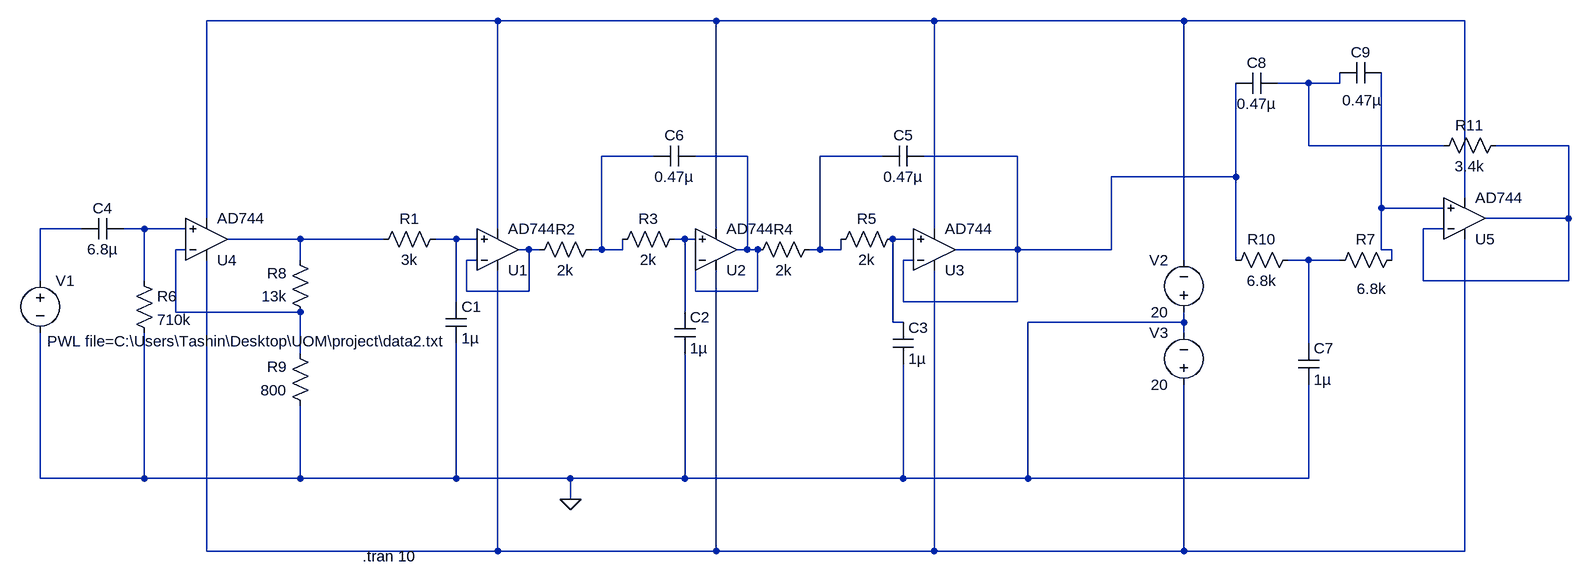
[diagram p0: schematic filter circuit.asc]
filter circuit.asc, the LTspice schematic file:
Version 4
SHEET 1 1656 680
WIRE 0 -272 -448 -272
WIRE 336 -272 0 -272
WIRE 672 -272 336 -272
WIRE 1056 -272 672 -272
WIRE 1488 -272 1056 -272
WIRE 1248 -176 1200 -176
WIRE 1296 -176 1296 -192
WIRE 1296 -176 1248 -176
WIRE 1248 -80 1248 -176
WIRE 1456 -80 1248 -80
WIRE 1648 -80 1536 -80
WIRE 240 -64 160 -64
WIRE 384 -64 304 -64
WIRE 592 -64 496 -64
WIRE 800 -64 656 -64
WIRE 1136 -32 1136 -176
WIRE 1136 -32 944 -32
WIRE 1488 0 1488 -272
WIRE 1360 16 1360 -192
WIRE 1456 16 1360 16
WIRE -448 32 -448 -272
WIRE 1648 32 1648 -80
WIRE 1648 32 1520 32
WIRE -640 48 -704 48
WIRE -544 48 -576 48
WIRE -480 48 -544 48
WIRE 0 48 0 -272
WIRE 336 48 336 -272
WIRE 672 48 672 -272
WIRE 1456 48 1424 48
WIRE -304 64 -416 64
WIRE -176 64 -304 64
WIRE -64 64 -96 64
WIRE -32 64 -64 64
WIRE 288 64 272 64
WIRE 304 64 288 64
WIRE 640 64 608 64
WIRE -480 80 -496 80
WIRE 48 80 32 80
WIRE 64 80 48 80
WIRE 160 80 160 -64
WIRE 160 80 144 80
WIRE 192 80 192 64
WIRE 192 80 160 80
WIRE 384 80 384 -64
WIRE 384 80 368 80
WIRE 400 80 384 80
WIRE 496 80 496 -64
WIRE 496 80 480 80
WIRE 528 80 528 64
WIRE 528 80 496 80
WIRE 800 80 800 -64
WIRE 800 80 704 80
WIRE 944 80 944 -32
WIRE 944 80 800 80
WIRE 1360 80 1360 16
WIRE 1376 80 1360 80
WIRE -304 96 -304 64
WIRE -32 96 -48 96
WIRE 640 96 624 96
WIRE 1056 96 1056 -272
WIRE 1136 96 1136 -32
WIRE 1248 96 1216 96
WIRE 1296 96 1248 96
WIRE 1376 96 1376 80
WIRE -704 128 -704 48
WIRE -544 128 -544 48
WIRE 1424 128 1424 48
WIRE 1648 128 1648 32
WIRE 1648 128 1424 128
WIRE -48 144 -48 96
WIRE 48 144 48 80
WIRE 48 144 -48 144
WIRE 304 144 304 96
WIRE 400 144 400 80
WIRE 400 144 304 144
WIRE -64 160 -64 64
WIRE 624 160 624 96
WIRE 800 160 800 80
WIRE 800 160 624 160
WIRE -496 176 -496 80
WIRE -304 176 -496 176
WIRE 288 176 288 64
WIRE 608 192 608 64
WIRE 624 192 608 192
WIRE 1056 192 1056 176
WIRE 1056 192 816 192
WIRE 1056 208 1056 192
WIRE 1248 224 1248 96
WIRE -304 240 -304 176
WIRE -704 432 -704 208
WIRE -544 432 -544 208
WIRE -544 432 -704 432
WIRE -304 432 -304 320
WIRE -304 432 -544 432
WIRE -64 432 -64 224
WIRE -64 432 -304 432
WIRE 112 432 -64 432
WIRE 288 432 288 240
WIRE 288 432 112 432
WIRE 624 432 624 256
WIRE 624 432 288 432
WIRE 816 432 816 192
WIRE 816 432 624 432
WIRE 1248 432 1248 288
WIRE 1248 432 816 432
WIRE 112 464 112 432
WIRE -448 544 -448 96
WIRE 0 544 0 112
WIRE 0 544 -448 544
WIRE 336 544 336 112
WIRE 336 544 0 544
WIRE 672 544 672 112
WIRE 672 544 336 544
WIRE 1056 544 1056 288
WIRE 1056 544 672 544
WIRE 1488 544 1488 64
WIRE 1488 544 1056 544
FLAG 112 464 0
DATAFLAG -176 96 ""
DATAFLAG -176 288 ""
SYMBOL OpAmps\\AD744 0 144 M180
SYMATTR InstName U1
SYMBOL OpAmps\\AD744 336 144 M180
SYMATTR InstName U2
SYMBOL OpAmps\\AD744 672 144 M180
SYMATTR InstName U3
SYMBOL res -80 48 R90
WINDOW 0 0 56 VBottom 2
WINDOW 3 32 56 VTop 2
SYMATTR InstName R1
SYMATTR Value 3k
SYMBOL res 160 64 R90
WINDOW 0 0 56 VBottom 2
WINDOW 3 32 56 VTop 2
SYMATTR InstName R2
SYMATTR Value 2k
SYMBOL res 288 48 R90
WINDOW 0 0 56 VBottom 2
WINDOW 3 32 56 VTop 2
SYMATTR InstName R3
SYMATTR Value 2k
SYMBOL res 496 64 R90
WINDOW 0 0 56 VBottom 2
WINDOW 3 32 56 VTop 2
SYMATTR InstName R4
SYMATTR Value 2k
SYMBOL res 624 48 R90
WINDOW 0 0 56 VBottom 2
WINDOW 3 32 56 VTop 2
SYMATTR InstName R5
SYMATTR Value 2k
SYMBOL cap -80 160 R0
SYMATTR InstName C1
SYMATTR Value 1µ
SYMBOL cap 272 176 R0
SYMATTR InstName C2
SYMATTR Value 1µ
SYMBOL cap 608 192 R0
SYMATTR InstName C3
SYMATTR Value 1µ
SYMBOL cap 656 -80 R90
WINDOW 0 0 32 VBottom 2
WINDOW 3 32 32 VTop 2
SYMATTR InstName C5
SYMATTR Value 0.47µ
SYMBOL cap 304 -80 R90
WINDOW 0 0 32 VBottom 2
WINDOW 3 32 32 VTop 2
SYMATTR InstName C6
SYMATTR Value 0.47µ
SYMBOL voltage -704 112 R0
WINDOW 123 0 0 Left 0
WINDOW 39 0 0 Left 0
WINDOW 3 11 109 Left 2
SYMATTR Value PWL file=C:\Users\Tashin\Desktop\UOM\project\data2.txt
SYMATTR InstName V1
SYMBOL voltage 1056 192 R180
WINDOW 0 24 96 Left 2
WINDOW 3 24 16 Left 2
WINDOW 123 0 0 Left 0
WINDOW 39 0 0 Left 0
SYMATTR InstName V2
SYMATTR Value 20
SYMBOL voltage 1056 304 R180
WINDOW 0 24 96 Left 2
WINDOW 3 24 16 Left 2
WINDOW 123 0 0 Left 0
WINDOW 39 0 0 Left 0
SYMATTR InstName V3
SYMATTR Value 20
SYMBOL OpAmps\\AD744 -448 128 M180
SYMATTR InstName U4
SYMBOL cap -576 32 R90
WINDOW 0 0 32 VBottom 2
WINDOW 3 32 32 VTop 2
SYMATTR InstName C4
SYMATTR Value 6.8µ
SYMBOL res -560 112 R0
SYMATTR InstName R6
SYMATTR Value 710k
SYMBOL res -288 192 R180
WINDOW 0 36 76 Left 2
WINDOW 3 36 40 Left 2
SYMATTR InstName R8
SYMATTR Value 13k
SYMBOL res -288 336 R180
WINDOW 0 36 76 Left 2
WINDOW 3 36 40 Left 2
SYMATTR InstName R9
SYMATTR Value 800
SYMBOL res 1392 80 R90
WINDOW 0 0 56 VBottom 2
WINDOW 3 45 47 VTop 2
SYMATTR InstName R7
SYMATTR Value 6.8k
SYMBOL res 1232 80 R90
WINDOW 0 0 56 VBottom 2
WINDOW 3 32 56 VTop 2
SYMATTR InstName R10
SYMATTR Value 6.8k
SYMBOL res 1552 -96 R90
WINDOW 0 0 56 VBottom 2
WINDOW 3 32 56 VTop 2
SYMATTR InstName R11
SYMATTR Value 3.4k
SYMBOL cap 1232 224 R0
SYMATTR InstName C7
SYMATTR Value 1µ
SYMBOL cap 1200 -192 R90
WINDOW 0 0 32 VBottom 2
WINDOW 3 32 32 VTop 2
SYMATTR InstName C8
SYMATTR Value 0.47µ
SYMBOL cap 1360 -208 R90
WINDOW 0 0 32 VBottom 2
WINDOW 3 43 30 VTop 2
SYMATTR InstName C9
SYMATTR Value 0.47µ
SYMBOL OpAmps\\AD744 1488 96 M180
SYMATTR InstName U5
TEXT -208 552 Left 2 !.tran 10

The netlist it stands for:
* filter circuit.asc
XU1 N012 N016 N018 N001 N016 AD744  ; pins In+ In- V+ V- OUT
XU2 N013 N005 N018 N001 N005 AD744  ; pins In+ In- V+ V- OUT
XU3 N014 N007 N018 N001 N007 AD744  ; pins In+ In- V+ V- OUT
R1 N012 N011 3k
R2 N004 N016 2k
R3 N013 N004 2k
R4 N006 N005 2k
R5 N014 N006 2k
C1 N012 0 1µ
C2 N013 0 1µ
C3 N014 0 1µ
C5 N007 N006 0.47µ
C6 N005 N004 0.47µ
V1 N009 0 PWL file=C:\Users\Tashin\Desktop\UOM\project\data2.txt
V2 0 N001 20
V3 N018 0 20
XU4 N010 N015 N018 N001 N011 AD744  ; pins In+ In- V+ V- OUT
C4 N010 N009 6.8µ
R6 N010 0 710k
R8 N015 N011 13k
R9 0 N015 800
R7 N008 N017 6.8k
R10 N017 N007 6.8k
R11 N003 N002 3.4k
C7 N017 0 1µ
C8 N002 N007 0.47µ
C9 N008 N002 0.47µ
XU5 N008 N003 N018 N001 N003 AD744  ; pins In+ In- V+ V- OUT
.tran 10
.backanno
.end